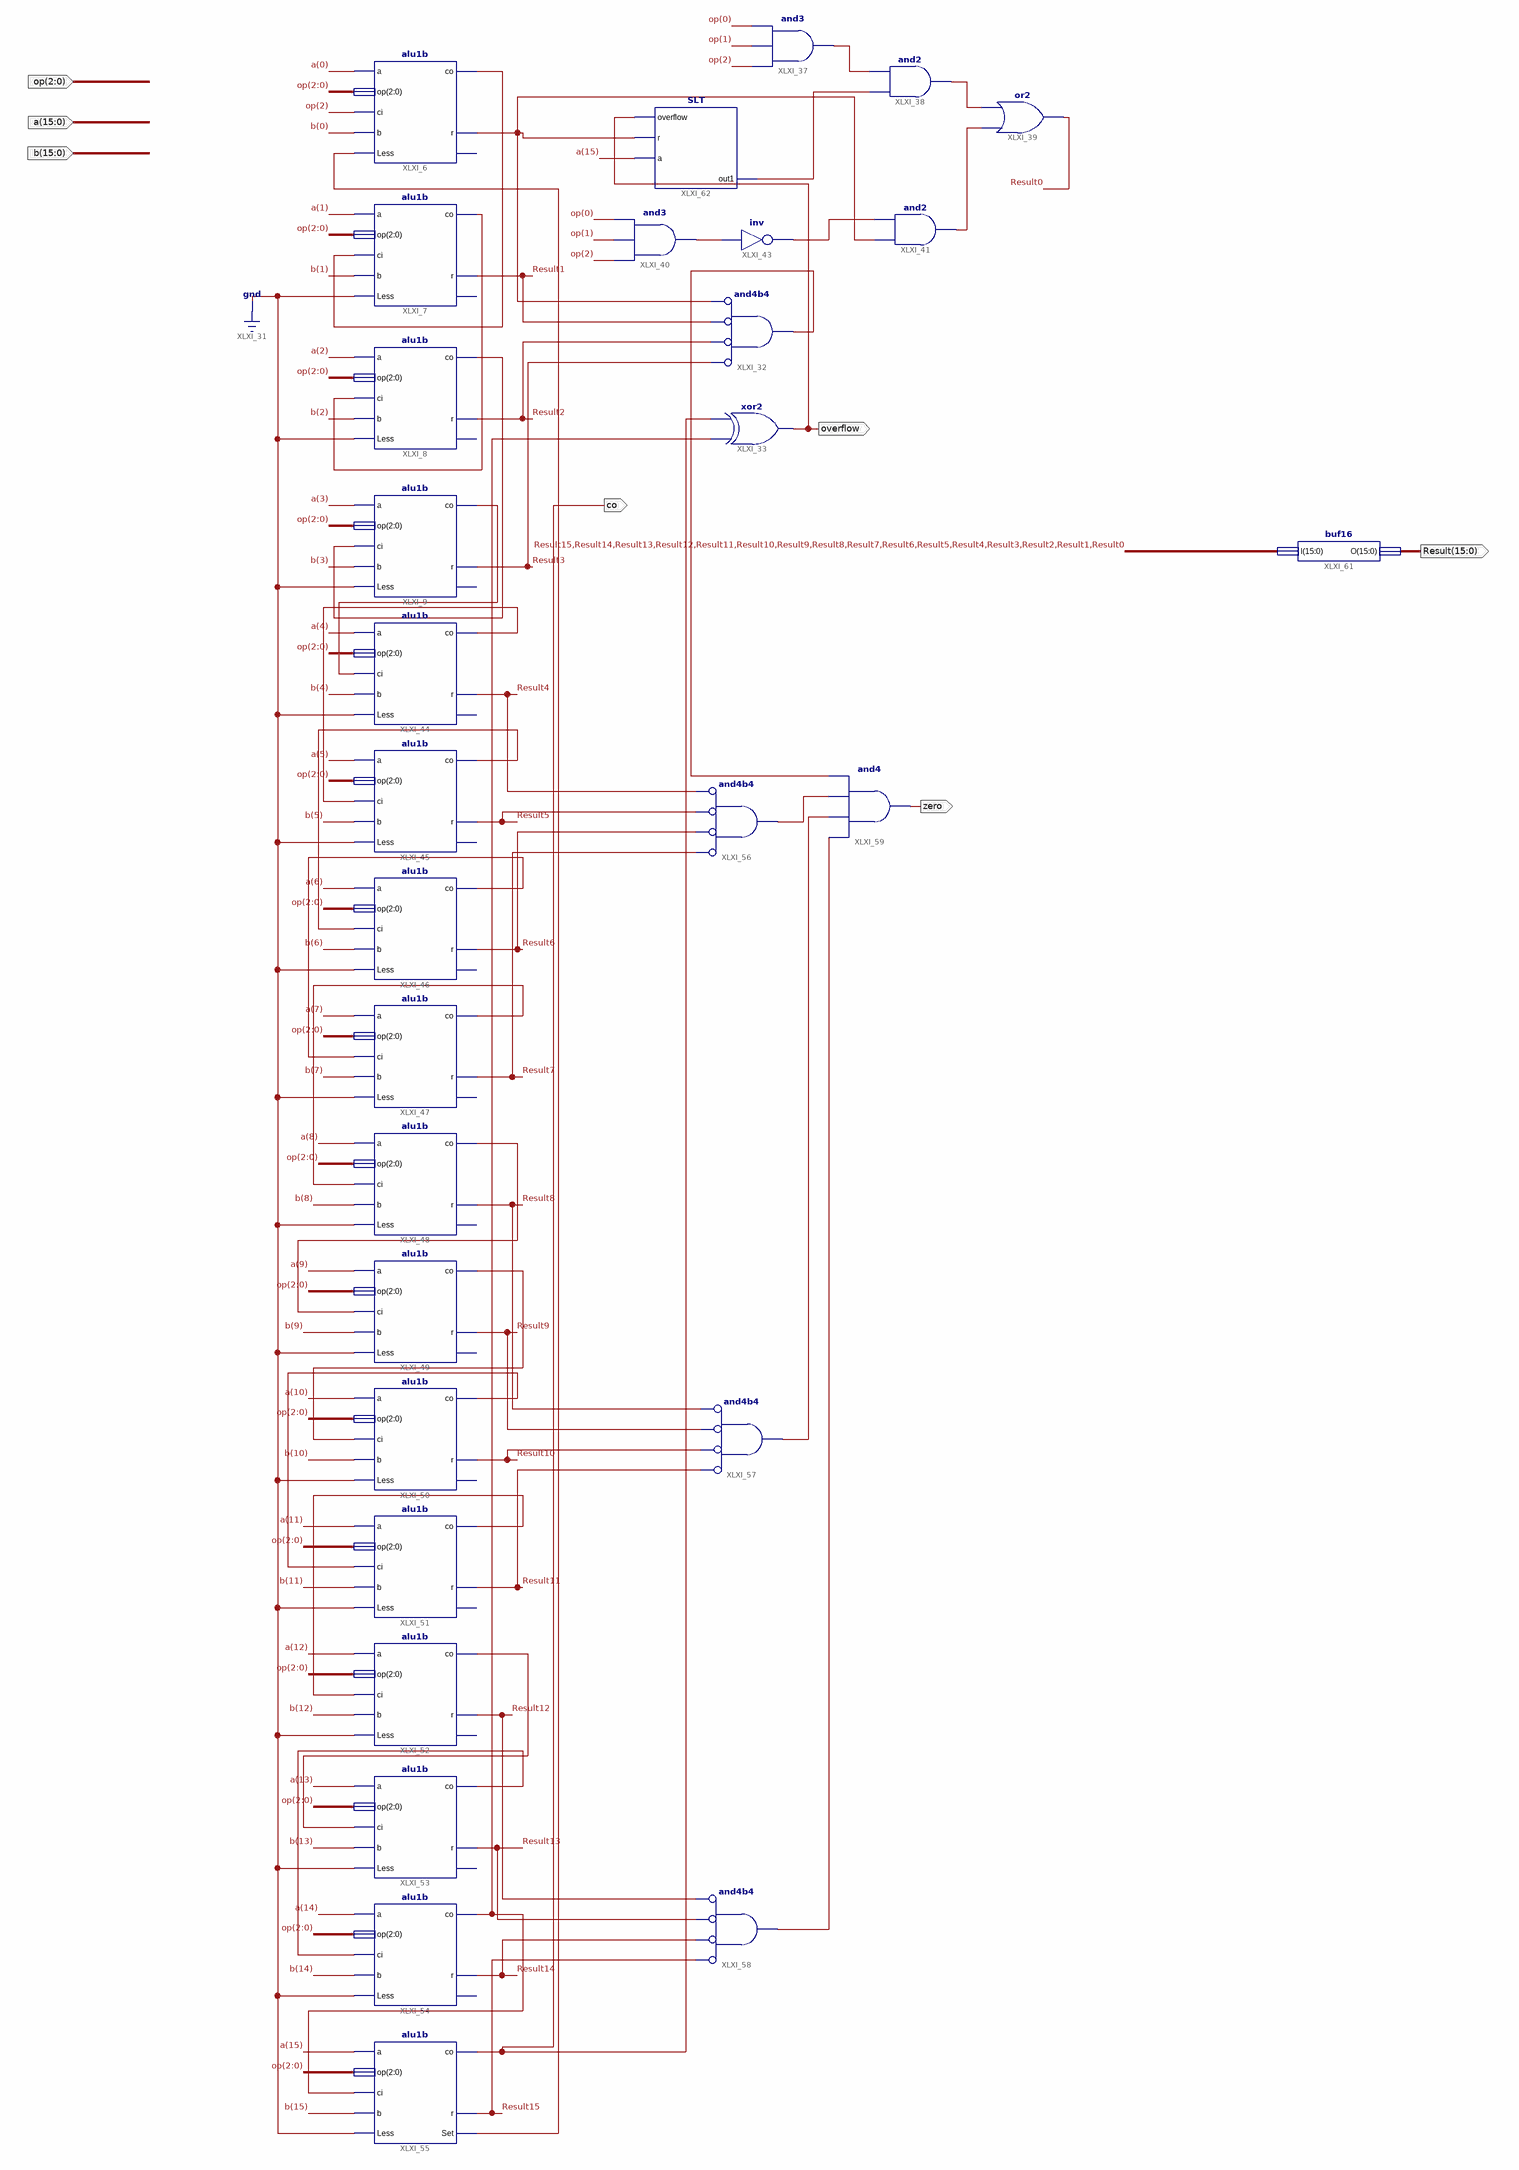
[diagram p0: schematic sheet 1]
// Xilinx ISE schematic alu.sch (spartan3e) as structural Verilog: 30 symbols, 7 ports
module alu (
  input  [2:0] op,
  input  [15:0] a,
  input  [15:0] b,
  output overflow,
  output co,
  output zero,
  output [15:0] Result
);

  wire Result00, Result0, Result1, Result2, Result3, Result4, Result5, Result6, Result7, Result8, Result9,
       Result10, Result11, Result12, Result13, Result14, Result15, XLXN_18, XLXN_19, XLXN_104, XLXN_106,
       XLXN_119, XLXN_123, XLXN_134, XLXN_135, XLXN_145, XLXN_149, XLXN_158, XLXN_162, XLXN_166, XLXN_170,
       XLXN_174, XLXN_199, XLXN_203, XLXN_207, XLXN_221, XLXN_222, XLXN_223, XLXN_247, XLXN_248, XLXN_249,
       XLXN_250, XLXN_253;

  alu1b XLXI_9 (.a(a[3]), .op(op), .ci(XLXN_221), .b(b[3]), .Less(1'b0), .co(XLXN_222), .r(Result3));  // open: Set
  alu1b XLXI_7 (.a(a[1]), .op(op), .ci(XLXN_18), .b(b[1]), .Less(1'b0), .co(XLXN_19), .r(Result1));  // open: Set
  alu1b XLXI_6 (.a(a[0]), .op(op), .ci(op[2]), .b(b[0]), .Less(XLXN_253), .co(XLXN_18), .r(Result00));  // open: Set
  alu1b XLXI_8 (.a(a[2]), .op(op), .ci(XLXN_19), .b(b[2]), .Less(1'b0), .co(XLXN_221), .r(Result2));  // open: Set
  and XLXI_32 (XLXN_247, ~Result3, ~Result2, ~Result1, ~Result00);  // and4b4
  xor XLXI_33 (overflow, XLXN_223, co);
  and XLXI_37 (XLXN_104, op[2], op[1], op[0]);
  and XLXI_38 (XLXN_106, XLXN_123, XLXN_104);
  or XLXI_39 (Result0, XLXN_119, XLXN_106);
  and XLXI_41 (XLXN_119, Result00, XLXN_134);
  not XLXI_43 (XLXN_134, XLXN_135);
  and XLXI_40 (XLXN_135, op[2], op[1], op[0]);
  alu1b XLXI_44 (.a(a[4]), .op(op), .ci(XLXN_222), .b(b[4]), .Less(1'b0), .co(XLXN_145), .r(Result4));  // open: Set
  alu1b XLXI_45 (.a(a[5]), .op(op), .ci(XLXN_145), .b(b[5]), .Less(1'b0), .co(XLXN_149), .r(Result5));  // open: Set
  alu1b XLXI_46 (.a(a[6]), .op(op), .ci(XLXN_149), .b(b[6]), .Less(1'b0), .co(XLXN_158), .r(Result6));  // open: Set
  alu1b XLXI_47 (.a(a[7]), .op(op), .ci(XLXN_158), .b(b[7]), .Less(1'b0), .co(XLXN_162), .r(Result7));  // open: Set
  alu1b XLXI_48 (.a(a[8]), .op(op), .ci(XLXN_162), .b(b[8]), .Less(1'b0), .co(XLXN_166), .r(Result8));  // open: Set
  alu1b XLXI_49 (.a(a[9]), .op(op), .ci(XLXN_166), .b(b[9]), .Less(1'b0), .co(XLXN_170), .r(Result9));  // open: Set
  alu1b XLXI_50 (.a(a[10]), .op(op), .ci(XLXN_170), .b(b[10]), .Less(1'b0), .co(XLXN_174), .r(Result10));  // open: Set
  alu1b XLXI_51 (.a(a[11]), .op(op), .ci(XLXN_174), .b(b[11]), .Less(1'b0), .co(XLXN_199), .r(Result11));  // open: Set
  alu1b XLXI_52 (.a(a[12]), .op(op), .ci(XLXN_199), .b(b[12]), .Less(1'b0), .co(XLXN_203), .r(Result12));  // open: Set
  alu1b XLXI_53 (.a(a[13]), .op(op), .ci(XLXN_203), .b(b[13]), .Less(1'b0), .co(XLXN_207), .r(Result13));  // open: Set
  alu1b XLXI_54 (.a(a[14]), .op(op), .ci(XLXN_207), .b(b[14]), .Less(1'b0), .co(XLXN_223), .r(Result14));  // open: Set
  alu1b XLXI_55 (.a(a[15]), .op(op), .ci(XLXN_223), .b(b[15]), .Less(1'b0), .co(co), .Set(XLXN_253), .r(Result15));
  and XLXI_56 (XLXN_248, ~Result7, ~Result6, ~Result5, ~Result4);  // and4b4
  and XLXI_57 (XLXN_249, ~Result11, ~Result10, ~Result9, ~Result8);  // and4b4
  and XLXI_58 (XLXN_250, ~Result15, ~Result14, ~Result13, ~Result12);  // and4b4
  and XLXI_59 (zero, XLXN_250, XLXN_249, XLXN_248, XLXN_247);
  buf16 XLXI_61 (
    .I({Result15, Result14, Result13, Result12, Result11, Result10, Result9, Result8, Result7, Result6, Result5, Result4, Result3, Result2, Result1, Result0}),
    .O(Result));
  SLT XLXI_62 (.overflow(overflow), .r(Result00), .a(a[15]), .out1(XLXN_123));
endmodule
